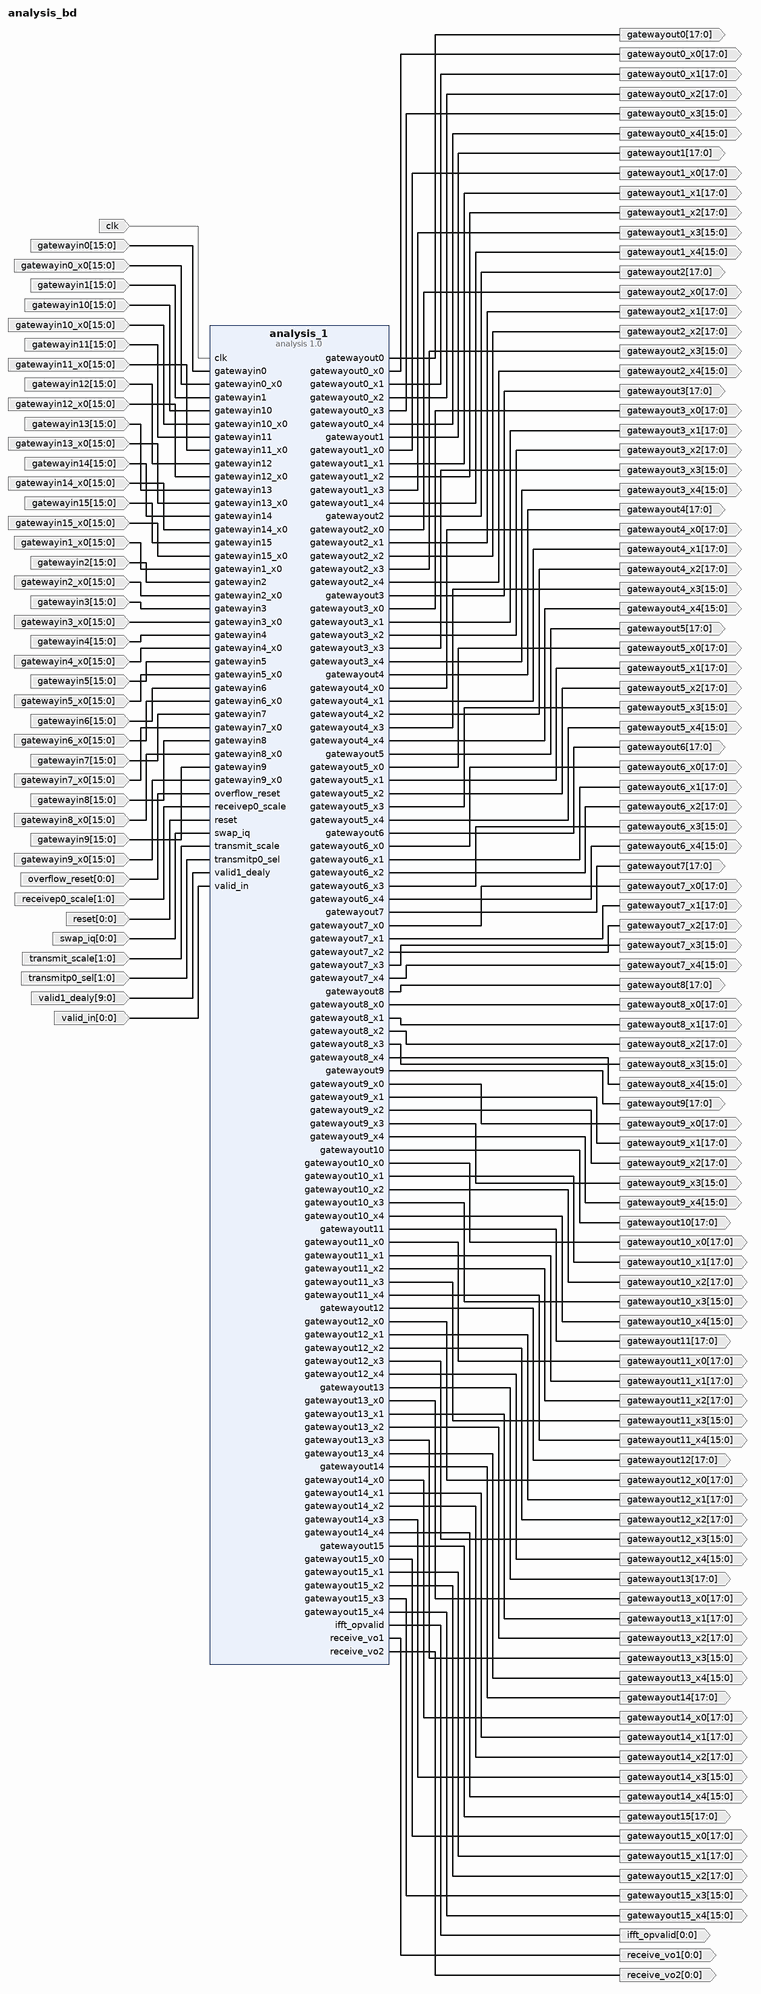
[diagram p0: block diagram of the top level]
# Vivado block design analysis_bd, xczu28dr-ffvg1517-1-e, Vivado 2019.1
create_bd_design analysis_bd

create_bd_port -dir I -type clk clk
create_bd_port -dir I -from 15 -to 0 -type data gatewayin0
create_bd_port -dir I -from 15 -to 0 -type data gatewayin0_x0
create_bd_port -dir I -from 15 -to 0 -type data gatewayin1
create_bd_port -dir I -from 15 -to 0 -type data gatewayin10
create_bd_port -dir I -from 15 -to 0 -type data gatewayin10_x0
create_bd_port -dir I -from 15 -to 0 -type data gatewayin11
create_bd_port -dir I -from 15 -to 0 -type data gatewayin11_x0
create_bd_port -dir I -from 15 -to 0 -type data gatewayin12
create_bd_port -dir I -from 15 -to 0 -type data gatewayin12_x0
create_bd_port -dir I -from 15 -to 0 -type data gatewayin13
create_bd_port -dir I -from 15 -to 0 -type data gatewayin13_x0
create_bd_port -dir I -from 15 -to 0 -type data gatewayin14
create_bd_port -dir I -from 15 -to 0 -type data gatewayin14_x0
create_bd_port -dir I -from 15 -to 0 -type data gatewayin15
create_bd_port -dir I -from 15 -to 0 -type data gatewayin15_x0
create_bd_port -dir I -from 15 -to 0 -type data gatewayin1_x0
create_bd_port -dir I -from 15 -to 0 -type data gatewayin2
create_bd_port -dir I -from 15 -to 0 -type data gatewayin2_x0
create_bd_port -dir I -from 15 -to 0 -type data gatewayin3
create_bd_port -dir I -from 15 -to 0 -type data gatewayin3_x0
create_bd_port -dir I -from 15 -to 0 -type data gatewayin4
create_bd_port -dir I -from 15 -to 0 -type data gatewayin4_x0
create_bd_port -dir I -from 15 -to 0 -type data gatewayin5
create_bd_port -dir I -from 15 -to 0 -type data gatewayin5_x0
create_bd_port -dir I -from 15 -to 0 -type data gatewayin6
create_bd_port -dir I -from 15 -to 0 -type data gatewayin6_x0
create_bd_port -dir I -from 15 -to 0 -type data gatewayin7
create_bd_port -dir I -from 15 -to 0 -type data gatewayin7_x0
create_bd_port -dir I -from 15 -to 0 -type data gatewayin8
create_bd_port -dir I -from 15 -to 0 -type data gatewayin8_x0
create_bd_port -dir I -from 15 -to 0 -type data gatewayin9
create_bd_port -dir I -from 15 -to 0 -type data gatewayin9_x0
create_bd_port -dir O -from 17 -to 0 -type data gatewayout0
create_bd_port -dir O -from 17 -to 0 -type data gatewayout0_x0
create_bd_port -dir O -from 17 -to 0 -type data gatewayout0_x1
create_bd_port -dir O -from 17 -to 0 -type data gatewayout0_x2
create_bd_port -dir O -from 15 -to 0 -type data gatewayout0_x3
create_bd_port -dir O -from 15 -to 0 -type data gatewayout0_x4
create_bd_port -dir O -from 17 -to 0 -type data gatewayout1
create_bd_port -dir O -from 17 -to 0 -type data gatewayout10
create_bd_port -dir O -from 17 -to 0 -type data gatewayout10_x0
create_bd_port -dir O -from 17 -to 0 -type data gatewayout10_x1
create_bd_port -dir O -from 17 -to 0 -type data gatewayout10_x2
create_bd_port -dir O -from 15 -to 0 -type data gatewayout10_x3
create_bd_port -dir O -from 15 -to 0 -type data gatewayout10_x4
create_bd_port -dir O -from 17 -to 0 -type data gatewayout11
create_bd_port -dir O -from 17 -to 0 -type data gatewayout11_x0
create_bd_port -dir O -from 17 -to 0 -type data gatewayout11_x1
create_bd_port -dir O -from 17 -to 0 -type data gatewayout11_x2
create_bd_port -dir O -from 15 -to 0 -type data gatewayout11_x3
create_bd_port -dir O -from 15 -to 0 -type data gatewayout11_x4
create_bd_port -dir O -from 17 -to 0 -type data gatewayout12
create_bd_port -dir O -from 17 -to 0 -type data gatewayout12_x0
create_bd_port -dir O -from 17 -to 0 -type data gatewayout12_x1
create_bd_port -dir O -from 17 -to 0 -type data gatewayout12_x2
create_bd_port -dir O -from 15 -to 0 -type data gatewayout12_x3
create_bd_port -dir O -from 15 -to 0 -type data gatewayout12_x4
create_bd_port -dir O -from 17 -to 0 -type data gatewayout13
create_bd_port -dir O -from 17 -to 0 -type data gatewayout13_x0
create_bd_port -dir O -from 17 -to 0 -type data gatewayout13_x1
create_bd_port -dir O -from 17 -to 0 -type data gatewayout13_x2
create_bd_port -dir O -from 15 -to 0 -type data gatewayout13_x3
create_bd_port -dir O -from 15 -to 0 -type data gatewayout13_x4
create_bd_port -dir O -from 17 -to 0 -type data gatewayout14
create_bd_port -dir O -from 17 -to 0 -type data gatewayout14_x0
create_bd_port -dir O -from 17 -to 0 -type data gatewayout14_x1
create_bd_port -dir O -from 17 -to 0 -type data gatewayout14_x2
create_bd_port -dir O -from 15 -to 0 -type data gatewayout14_x3
create_bd_port -dir O -from 15 -to 0 -type data gatewayout14_x4
create_bd_port -dir O -from 17 -to 0 -type data gatewayout15
create_bd_port -dir O -from 17 -to 0 -type data gatewayout15_x0
create_bd_port -dir O -from 17 -to 0 -type data gatewayout15_x1
create_bd_port -dir O -from 17 -to 0 -type data gatewayout15_x2
create_bd_port -dir O -from 15 -to 0 -type data gatewayout15_x3
create_bd_port -dir O -from 15 -to 0 -type data gatewayout15_x4
create_bd_port -dir O -from 17 -to 0 -type data gatewayout1_x0
create_bd_port -dir O -from 17 -to 0 -type data gatewayout1_x1
create_bd_port -dir O -from 17 -to 0 -type data gatewayout1_x2
create_bd_port -dir O -from 15 -to 0 -type data gatewayout1_x3
create_bd_port -dir O -from 15 -to 0 -type data gatewayout1_x4
create_bd_port -dir O -from 17 -to 0 -type data gatewayout2
create_bd_port -dir O -from 17 -to 0 -type data gatewayout2_x0
create_bd_port -dir O -from 17 -to 0 -type data gatewayout2_x1
create_bd_port -dir O -from 17 -to 0 -type data gatewayout2_x2
create_bd_port -dir O -from 15 -to 0 -type data gatewayout2_x3
create_bd_port -dir O -from 15 -to 0 -type data gatewayout2_x4
create_bd_port -dir O -from 17 -to 0 -type data gatewayout3
create_bd_port -dir O -from 17 -to 0 -type data gatewayout3_x0
create_bd_port -dir O -from 17 -to 0 -type data gatewayout3_x1
create_bd_port -dir O -from 17 -to 0 -type data gatewayout3_x2
create_bd_port -dir O -from 15 -to 0 -type data gatewayout3_x3
create_bd_port -dir O -from 15 -to 0 -type data gatewayout3_x4
create_bd_port -dir O -from 17 -to 0 -type data gatewayout4
create_bd_port -dir O -from 17 -to 0 -type data gatewayout4_x0
create_bd_port -dir O -from 17 -to 0 -type data gatewayout4_x1
create_bd_port -dir O -from 17 -to 0 -type data gatewayout4_x2
create_bd_port -dir O -from 15 -to 0 -type data gatewayout4_x3
create_bd_port -dir O -from 15 -to 0 -type data gatewayout4_x4
create_bd_port -dir O -from 17 -to 0 -type data gatewayout5
create_bd_port -dir O -from 17 -to 0 -type data gatewayout5_x0
create_bd_port -dir O -from 17 -to 0 -type data gatewayout5_x1
create_bd_port -dir O -from 17 -to 0 -type data gatewayout5_x2
create_bd_port -dir O -from 15 -to 0 -type data gatewayout5_x3
create_bd_port -dir O -from 15 -to 0 -type data gatewayout5_x4
create_bd_port -dir O -from 17 -to 0 -type data gatewayout6
create_bd_port -dir O -from 17 -to 0 -type data gatewayout6_x0
create_bd_port -dir O -from 17 -to 0 -type data gatewayout6_x1
create_bd_port -dir O -from 17 -to 0 -type data gatewayout6_x2
create_bd_port -dir O -from 15 -to 0 -type data gatewayout6_x3
create_bd_port -dir O -from 15 -to 0 -type data gatewayout6_x4
create_bd_port -dir O -from 17 -to 0 -type data gatewayout7
create_bd_port -dir O -from 17 -to 0 -type data gatewayout7_x0
create_bd_port -dir O -from 17 -to 0 -type data gatewayout7_x1
create_bd_port -dir O -from 17 -to 0 -type data gatewayout7_x2
create_bd_port -dir O -from 15 -to 0 -type data gatewayout7_x3
create_bd_port -dir O -from 15 -to 0 -type data gatewayout7_x4
create_bd_port -dir O -from 17 -to 0 -type data gatewayout8
create_bd_port -dir O -from 17 -to 0 -type data gatewayout8_x0
create_bd_port -dir O -from 17 -to 0 -type data gatewayout8_x1
create_bd_port -dir O -from 17 -to 0 -type data gatewayout8_x2
create_bd_port -dir O -from 15 -to 0 -type data gatewayout8_x3
create_bd_port -dir O -from 15 -to 0 -type data gatewayout8_x4
create_bd_port -dir O -from 17 -to 0 -type data gatewayout9
create_bd_port -dir O -from 17 -to 0 -type data gatewayout9_x0
create_bd_port -dir O -from 17 -to 0 -type data gatewayout9_x1
create_bd_port -dir O -from 17 -to 0 -type data gatewayout9_x2
create_bd_port -dir O -from 15 -to 0 -type data gatewayout9_x3
create_bd_port -dir O -from 15 -to 0 -type data gatewayout9_x4
create_bd_port -dir O -from 0 -to 0 -type data ifft_opvalid
create_bd_port -dir I -from 0 -to 0 -type rst overflow_reset
create_bd_port -dir O -from 0 -to 0 -type data receive_vo1
create_bd_port -dir O -from 0 -to 0 -type data receive_vo2
create_bd_port -dir I -from 1 -to 0 -type data receivep0_scale
create_bd_port -dir I -from 0 -to 0 -type rst reset
create_bd_port -dir I -from 0 -to 0 -type data swap_iq
create_bd_port -dir I -from 1 -to 0 -type data transmit_scale
create_bd_port -dir I -from 1 -to 0 -type data transmitp0_sel
create_bd_port -dir I -from 9 -to 0 -type data valid1_dealy
create_bd_port -dir I -from 0 -to 0 -type data valid_in

create_bd_cell -type ip -vlnv SLAC:SysGen:analysis:1.0 analysis_1

# ---- connections ----

connect_bd_net [get_bd_ports clk] [get_bd_pins analysis_1/clk]
connect_bd_net -net gatewayin0_1 [get_bd_ports gatewayin0] [get_bd_pins analysis_1/gatewayin0]
connect_bd_net -net gatewayin0_x0_1 [get_bd_ports gatewayin0_x0] [get_bd_pins analysis_1/gatewayin0_x0]
connect_bd_net -net gatewayin1_1 [get_bd_ports gatewayin1] [get_bd_pins analysis_1/gatewayin1]
connect_bd_net -net gatewayin10_1 [get_bd_ports gatewayin10] [get_bd_pins analysis_1/gatewayin10]
connect_bd_net -net gatewayin10_x0_1 [get_bd_ports gatewayin10_x0] [get_bd_pins analysis_1/gatewayin10_x0]
connect_bd_net -net gatewayin11_1 [get_bd_ports gatewayin11] [get_bd_pins analysis_1/gatewayin11]
connect_bd_net -net gatewayin11_x0_1 [get_bd_ports gatewayin11_x0] [get_bd_pins analysis_1/gatewayin11_x0]
connect_bd_net -net gatewayin12_1 [get_bd_ports gatewayin12] [get_bd_pins analysis_1/gatewayin12]
connect_bd_net -net gatewayin12_x0_1 [get_bd_ports gatewayin12_x0] [get_bd_pins analysis_1/gatewayin12_x0]
connect_bd_net -net gatewayin13_1 [get_bd_ports gatewayin13] [get_bd_pins analysis_1/gatewayin13]
connect_bd_net -net gatewayin13_x0_1 [get_bd_ports gatewayin13_x0] [get_bd_pins analysis_1/gatewayin13_x0]
connect_bd_net -net gatewayin14_1 [get_bd_ports gatewayin14] [get_bd_pins analysis_1/gatewayin14]
connect_bd_net -net gatewayin14_x0_1 [get_bd_ports gatewayin14_x0] [get_bd_pins analysis_1/gatewayin14_x0]
connect_bd_net -net gatewayin15_1 [get_bd_ports gatewayin15] [get_bd_pins analysis_1/gatewayin15]
connect_bd_net -net gatewayin15_x0_1 [get_bd_ports gatewayin15_x0] [get_bd_pins analysis_1/gatewayin15_x0]
connect_bd_net -net gatewayin1_x0_1 [get_bd_ports gatewayin1_x0] [get_bd_pins analysis_1/gatewayin1_x0]
connect_bd_net -net gatewayin2_1 [get_bd_ports gatewayin2] [get_bd_pins analysis_1/gatewayin2]
connect_bd_net -net gatewayin2_x0_1 [get_bd_ports gatewayin2_x0] [get_bd_pins analysis_1/gatewayin2_x0]
connect_bd_net -net gatewayin3_1 [get_bd_ports gatewayin3] [get_bd_pins analysis_1/gatewayin3]
connect_bd_net -net gatewayin3_x0_1 [get_bd_ports gatewayin3_x0] [get_bd_pins analysis_1/gatewayin3_x0]
connect_bd_net -net gatewayin4_1 [get_bd_ports gatewayin4] [get_bd_pins analysis_1/gatewayin4]
connect_bd_net -net gatewayin4_x0_1 [get_bd_ports gatewayin4_x0] [get_bd_pins analysis_1/gatewayin4_x0]
connect_bd_net -net gatewayin5_1 [get_bd_ports gatewayin5] [get_bd_pins analysis_1/gatewayin5]
connect_bd_net -net gatewayin5_x0_1 [get_bd_ports gatewayin5_x0] [get_bd_pins analysis_1/gatewayin5_x0]
connect_bd_net -net gatewayin6_1 [get_bd_ports gatewayin6] [get_bd_pins analysis_1/gatewayin6]
connect_bd_net -net gatewayin6_x0_1 [get_bd_ports gatewayin6_x0] [get_bd_pins analysis_1/gatewayin6_x0]
connect_bd_net -net gatewayin7_1 [get_bd_ports gatewayin7] [get_bd_pins analysis_1/gatewayin7]
connect_bd_net -net gatewayin7_x0_1 [get_bd_ports gatewayin7_x0] [get_bd_pins analysis_1/gatewayin7_x0]
connect_bd_net -net gatewayin8_1 [get_bd_ports gatewayin8] [get_bd_pins analysis_1/gatewayin8]
connect_bd_net -net gatewayin8_x0_1 [get_bd_ports gatewayin8_x0] [get_bd_pins analysis_1/gatewayin8_x0]
connect_bd_net -net gatewayin9_1 [get_bd_ports gatewayin9] [get_bd_pins analysis_1/gatewayin9]
connect_bd_net -net gatewayin9_x0_1 [get_bd_ports gatewayin9_x0] [get_bd_pins analysis_1/gatewayin9_x0]
connect_bd_net [get_bd_pins analysis_1/gatewayout0] [get_bd_ports gatewayout0]
connect_bd_net [get_bd_pins analysis_1/gatewayout0_x0] [get_bd_ports gatewayout0_x0]
connect_bd_net [get_bd_pins analysis_1/gatewayout0_x1] [get_bd_ports gatewayout0_x1]
connect_bd_net [get_bd_pins analysis_1/gatewayout0_x2] [get_bd_ports gatewayout0_x2]
connect_bd_net [get_bd_pins analysis_1/gatewayout0_x3] [get_bd_ports gatewayout0_x3]
connect_bd_net [get_bd_pins analysis_1/gatewayout0_x4] [get_bd_ports gatewayout0_x4]
connect_bd_net [get_bd_pins analysis_1/gatewayout1] [get_bd_ports gatewayout1]
connect_bd_net [get_bd_pins analysis_1/gatewayout10] [get_bd_ports gatewayout10]
connect_bd_net [get_bd_pins analysis_1/gatewayout10_x0] [get_bd_ports gatewayout10_x0]
connect_bd_net [get_bd_pins analysis_1/gatewayout10_x1] [get_bd_ports gatewayout10_x1]
connect_bd_net [get_bd_pins analysis_1/gatewayout10_x2] [get_bd_ports gatewayout10_x2]
connect_bd_net [get_bd_pins analysis_1/gatewayout10_x3] [get_bd_ports gatewayout10_x3]
connect_bd_net [get_bd_pins analysis_1/gatewayout10_x4] [get_bd_ports gatewayout10_x4]
connect_bd_net [get_bd_pins analysis_1/gatewayout11] [get_bd_ports gatewayout11]
connect_bd_net [get_bd_pins analysis_1/gatewayout11_x0] [get_bd_ports gatewayout11_x0]
connect_bd_net [get_bd_pins analysis_1/gatewayout11_x1] [get_bd_ports gatewayout11_x1]
connect_bd_net [get_bd_pins analysis_1/gatewayout11_x2] [get_bd_ports gatewayout11_x2]
connect_bd_net [get_bd_pins analysis_1/gatewayout11_x3] [get_bd_ports gatewayout11_x3]
connect_bd_net [get_bd_pins analysis_1/gatewayout11_x4] [get_bd_ports gatewayout11_x4]
connect_bd_net [get_bd_pins analysis_1/gatewayout12] [get_bd_ports gatewayout12]
connect_bd_net [get_bd_pins analysis_1/gatewayout12_x0] [get_bd_ports gatewayout12_x0]
connect_bd_net [get_bd_pins analysis_1/gatewayout12_x1] [get_bd_ports gatewayout12_x1]
connect_bd_net [get_bd_pins analysis_1/gatewayout12_x2] [get_bd_ports gatewayout12_x2]
connect_bd_net [get_bd_pins analysis_1/gatewayout12_x3] [get_bd_ports gatewayout12_x3]
connect_bd_net [get_bd_pins analysis_1/gatewayout12_x4] [get_bd_ports gatewayout12_x4]
connect_bd_net [get_bd_pins analysis_1/gatewayout13] [get_bd_ports gatewayout13]
connect_bd_net [get_bd_pins analysis_1/gatewayout13_x0] [get_bd_ports gatewayout13_x0]
connect_bd_net [get_bd_pins analysis_1/gatewayout13_x1] [get_bd_ports gatewayout13_x1]
connect_bd_net [get_bd_pins analysis_1/gatewayout13_x2] [get_bd_ports gatewayout13_x2]
connect_bd_net [get_bd_pins analysis_1/gatewayout13_x3] [get_bd_ports gatewayout13_x3]
connect_bd_net [get_bd_pins analysis_1/gatewayout13_x4] [get_bd_ports gatewayout13_x4]
connect_bd_net [get_bd_pins analysis_1/gatewayout14] [get_bd_ports gatewayout14]
connect_bd_net [get_bd_pins analysis_1/gatewayout14_x0] [get_bd_ports gatewayout14_x0]
connect_bd_net [get_bd_pins analysis_1/gatewayout14_x1] [get_bd_ports gatewayout14_x1]
connect_bd_net [get_bd_pins analysis_1/gatewayout14_x2] [get_bd_ports gatewayout14_x2]
connect_bd_net [get_bd_pins analysis_1/gatewayout14_x3] [get_bd_ports gatewayout14_x3]
connect_bd_net [get_bd_pins analysis_1/gatewayout14_x4] [get_bd_ports gatewayout14_x4]
connect_bd_net [get_bd_pins analysis_1/gatewayout15] [get_bd_ports gatewayout15]
connect_bd_net [get_bd_pins analysis_1/gatewayout15_x0] [get_bd_ports gatewayout15_x0]
connect_bd_net [get_bd_pins analysis_1/gatewayout15_x1] [get_bd_ports gatewayout15_x1]
connect_bd_net [get_bd_pins analysis_1/gatewayout15_x2] [get_bd_ports gatewayout15_x2]
connect_bd_net [get_bd_pins analysis_1/gatewayout15_x3] [get_bd_ports gatewayout15_x3]
connect_bd_net [get_bd_pins analysis_1/gatewayout15_x4] [get_bd_ports gatewayout15_x4]
connect_bd_net [get_bd_pins analysis_1/gatewayout1_x0] [get_bd_ports gatewayout1_x0]
connect_bd_net [get_bd_pins analysis_1/gatewayout1_x1] [get_bd_ports gatewayout1_x1]
connect_bd_net [get_bd_pins analysis_1/gatewayout1_x2] [get_bd_ports gatewayout1_x2]
connect_bd_net [get_bd_pins analysis_1/gatewayout1_x3] [get_bd_ports gatewayout1_x3]
connect_bd_net [get_bd_pins analysis_1/gatewayout1_x4] [get_bd_ports gatewayout1_x4]
connect_bd_net [get_bd_pins analysis_1/gatewayout2] [get_bd_ports gatewayout2]
connect_bd_net [get_bd_pins analysis_1/gatewayout2_x0] [get_bd_ports gatewayout2_x0]
connect_bd_net [get_bd_pins analysis_1/gatewayout2_x1] [get_bd_ports gatewayout2_x1]
connect_bd_net [get_bd_pins analysis_1/gatewayout2_x2] [get_bd_ports gatewayout2_x2]
connect_bd_net [get_bd_pins analysis_1/gatewayout2_x3] [get_bd_ports gatewayout2_x3]
connect_bd_net [get_bd_pins analysis_1/gatewayout2_x4] [get_bd_ports gatewayout2_x4]
connect_bd_net [get_bd_pins analysis_1/gatewayout3] [get_bd_ports gatewayout3]
connect_bd_net [get_bd_pins analysis_1/gatewayout3_x0] [get_bd_ports gatewayout3_x0]
connect_bd_net [get_bd_pins analysis_1/gatewayout3_x1] [get_bd_ports gatewayout3_x1]
connect_bd_net [get_bd_pins analysis_1/gatewayout3_x2] [get_bd_ports gatewayout3_x2]
connect_bd_net [get_bd_pins analysis_1/gatewayout3_x3] [get_bd_ports gatewayout3_x3]
connect_bd_net [get_bd_pins analysis_1/gatewayout3_x4] [get_bd_ports gatewayout3_x4]
connect_bd_net [get_bd_pins analysis_1/gatewayout4] [get_bd_ports gatewayout4]
connect_bd_net [get_bd_pins analysis_1/gatewayout4_x0] [get_bd_ports gatewayout4_x0]
connect_bd_net [get_bd_pins analysis_1/gatewayout4_x1] [get_bd_ports gatewayout4_x1]
connect_bd_net [get_bd_pins analysis_1/gatewayout4_x2] [get_bd_ports gatewayout4_x2]
connect_bd_net [get_bd_pins analysis_1/gatewayout4_x3] [get_bd_ports gatewayout4_x3]
connect_bd_net [get_bd_pins analysis_1/gatewayout4_x4] [get_bd_ports gatewayout4_x4]
connect_bd_net [get_bd_pins analysis_1/gatewayout5] [get_bd_ports gatewayout5]
connect_bd_net [get_bd_pins analysis_1/gatewayout5_x0] [get_bd_ports gatewayout5_x0]
connect_bd_net [get_bd_pins analysis_1/gatewayout5_x1] [get_bd_ports gatewayout5_x1]
connect_bd_net [get_bd_pins analysis_1/gatewayout5_x2] [get_bd_ports gatewayout5_x2]
connect_bd_net [get_bd_pins analysis_1/gatewayout5_x3] [get_bd_ports gatewayout5_x3]
connect_bd_net [get_bd_pins analysis_1/gatewayout5_x4] [get_bd_ports gatewayout5_x4]
connect_bd_net [get_bd_pins analysis_1/gatewayout6] [get_bd_ports gatewayout6]
connect_bd_net [get_bd_pins analysis_1/gatewayout6_x0] [get_bd_ports gatewayout6_x0]
connect_bd_net [get_bd_pins analysis_1/gatewayout6_x1] [get_bd_ports gatewayout6_x1]
connect_bd_net [get_bd_pins analysis_1/gatewayout6_x2] [get_bd_ports gatewayout6_x2]
connect_bd_net [get_bd_pins analysis_1/gatewayout6_x3] [get_bd_ports gatewayout6_x3]
connect_bd_net [get_bd_pins analysis_1/gatewayout6_x4] [get_bd_ports gatewayout6_x4]
connect_bd_net [get_bd_pins analysis_1/gatewayout7] [get_bd_ports gatewayout7]
connect_bd_net [get_bd_pins analysis_1/gatewayout7_x0] [get_bd_ports gatewayout7_x0]
connect_bd_net [get_bd_pins analysis_1/gatewayout7_x1] [get_bd_ports gatewayout7_x1]
connect_bd_net [get_bd_pins analysis_1/gatewayout7_x2] [get_bd_ports gatewayout7_x2]
connect_bd_net [get_bd_pins analysis_1/gatewayout7_x3] [get_bd_ports gatewayout7_x3]
connect_bd_net [get_bd_pins analysis_1/gatewayout7_x4] [get_bd_ports gatewayout7_x4]
connect_bd_net [get_bd_pins analysis_1/gatewayout8] [get_bd_ports gatewayout8]
connect_bd_net [get_bd_pins analysis_1/gatewayout8_x0] [get_bd_ports gatewayout8_x0]
connect_bd_net [get_bd_pins analysis_1/gatewayout8_x1] [get_bd_ports gatewayout8_x1]
connect_bd_net [get_bd_pins analysis_1/gatewayout8_x2] [get_bd_ports gatewayout8_x2]
connect_bd_net [get_bd_pins analysis_1/gatewayout8_x3] [get_bd_ports gatewayout8_x3]
connect_bd_net [get_bd_pins analysis_1/gatewayout8_x4] [get_bd_ports gatewayout8_x4]
connect_bd_net [get_bd_pins analysis_1/gatewayout9] [get_bd_ports gatewayout9]
connect_bd_net [get_bd_pins analysis_1/gatewayout9_x0] [get_bd_ports gatewayout9_x0]
connect_bd_net [get_bd_pins analysis_1/gatewayout9_x1] [get_bd_ports gatewayout9_x1]
connect_bd_net [get_bd_pins analysis_1/gatewayout9_x2] [get_bd_ports gatewayout9_x2]
connect_bd_net [get_bd_pins analysis_1/gatewayout9_x3] [get_bd_ports gatewayout9_x3]
connect_bd_net [get_bd_pins analysis_1/gatewayout9_x4] [get_bd_ports gatewayout9_x4]
connect_bd_net [get_bd_pins analysis_1/ifft_opvalid] [get_bd_ports ifft_opvalid]
connect_bd_net [get_bd_ports overflow_reset] [get_bd_pins analysis_1/overflow_reset]
connect_bd_net [get_bd_pins analysis_1/receive_vo1] [get_bd_ports receive_vo1]
connect_bd_net [get_bd_pins analysis_1/receive_vo2] [get_bd_ports receive_vo2]
connect_bd_net [get_bd_ports receivep0_scale] [get_bd_pins analysis_1/receivep0_scale]
connect_bd_net [get_bd_ports reset] [get_bd_pins analysis_1/reset]
connect_bd_net [get_bd_ports swap_iq] [get_bd_pins analysis_1/swap_iq]
connect_bd_net [get_bd_ports transmit_scale] [get_bd_pins analysis_1/transmit_scale]
connect_bd_net [get_bd_ports transmitp0_sel] [get_bd_pins analysis_1/transmitp0_sel]
connect_bd_net [get_bd_ports valid1_dealy] [get_bd_pins analysis_1/valid1_dealy]
connect_bd_net [get_bd_ports valid_in] [get_bd_pins analysis_1/valid_in]

validate_bd_design
save_bd_design
